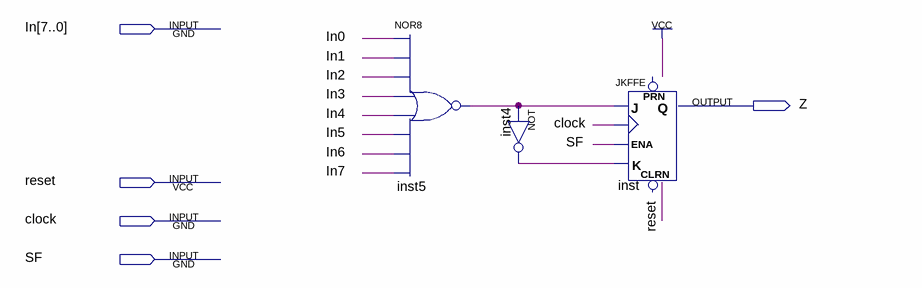
[diagram p0: schematic sheet]
// Quartus schematic Zflag.bdf as structural Verilog: 3 symbols, 5 pins
module Zflag (
  input  [7:0] In,
  input  reset,
  input  clock,
  input  SF,
  output Z
);

  wire inst4_out, inst5_out;

  nor inst5 (inst5_out, In[0], In[1], In[2], In[3], In[4], In[5], In[6], In[7]);
  not inst4 (inst4_out, inst5_out);
  JKFFE inst (.J(inst5_out), .CLK(clock), .K(inst4_out), .ENA(SF), .Q(Z));  // open: PRN, CLRN
endmodule
